# EAGLE schematic mcu_v01 (EAGLE 6.1)
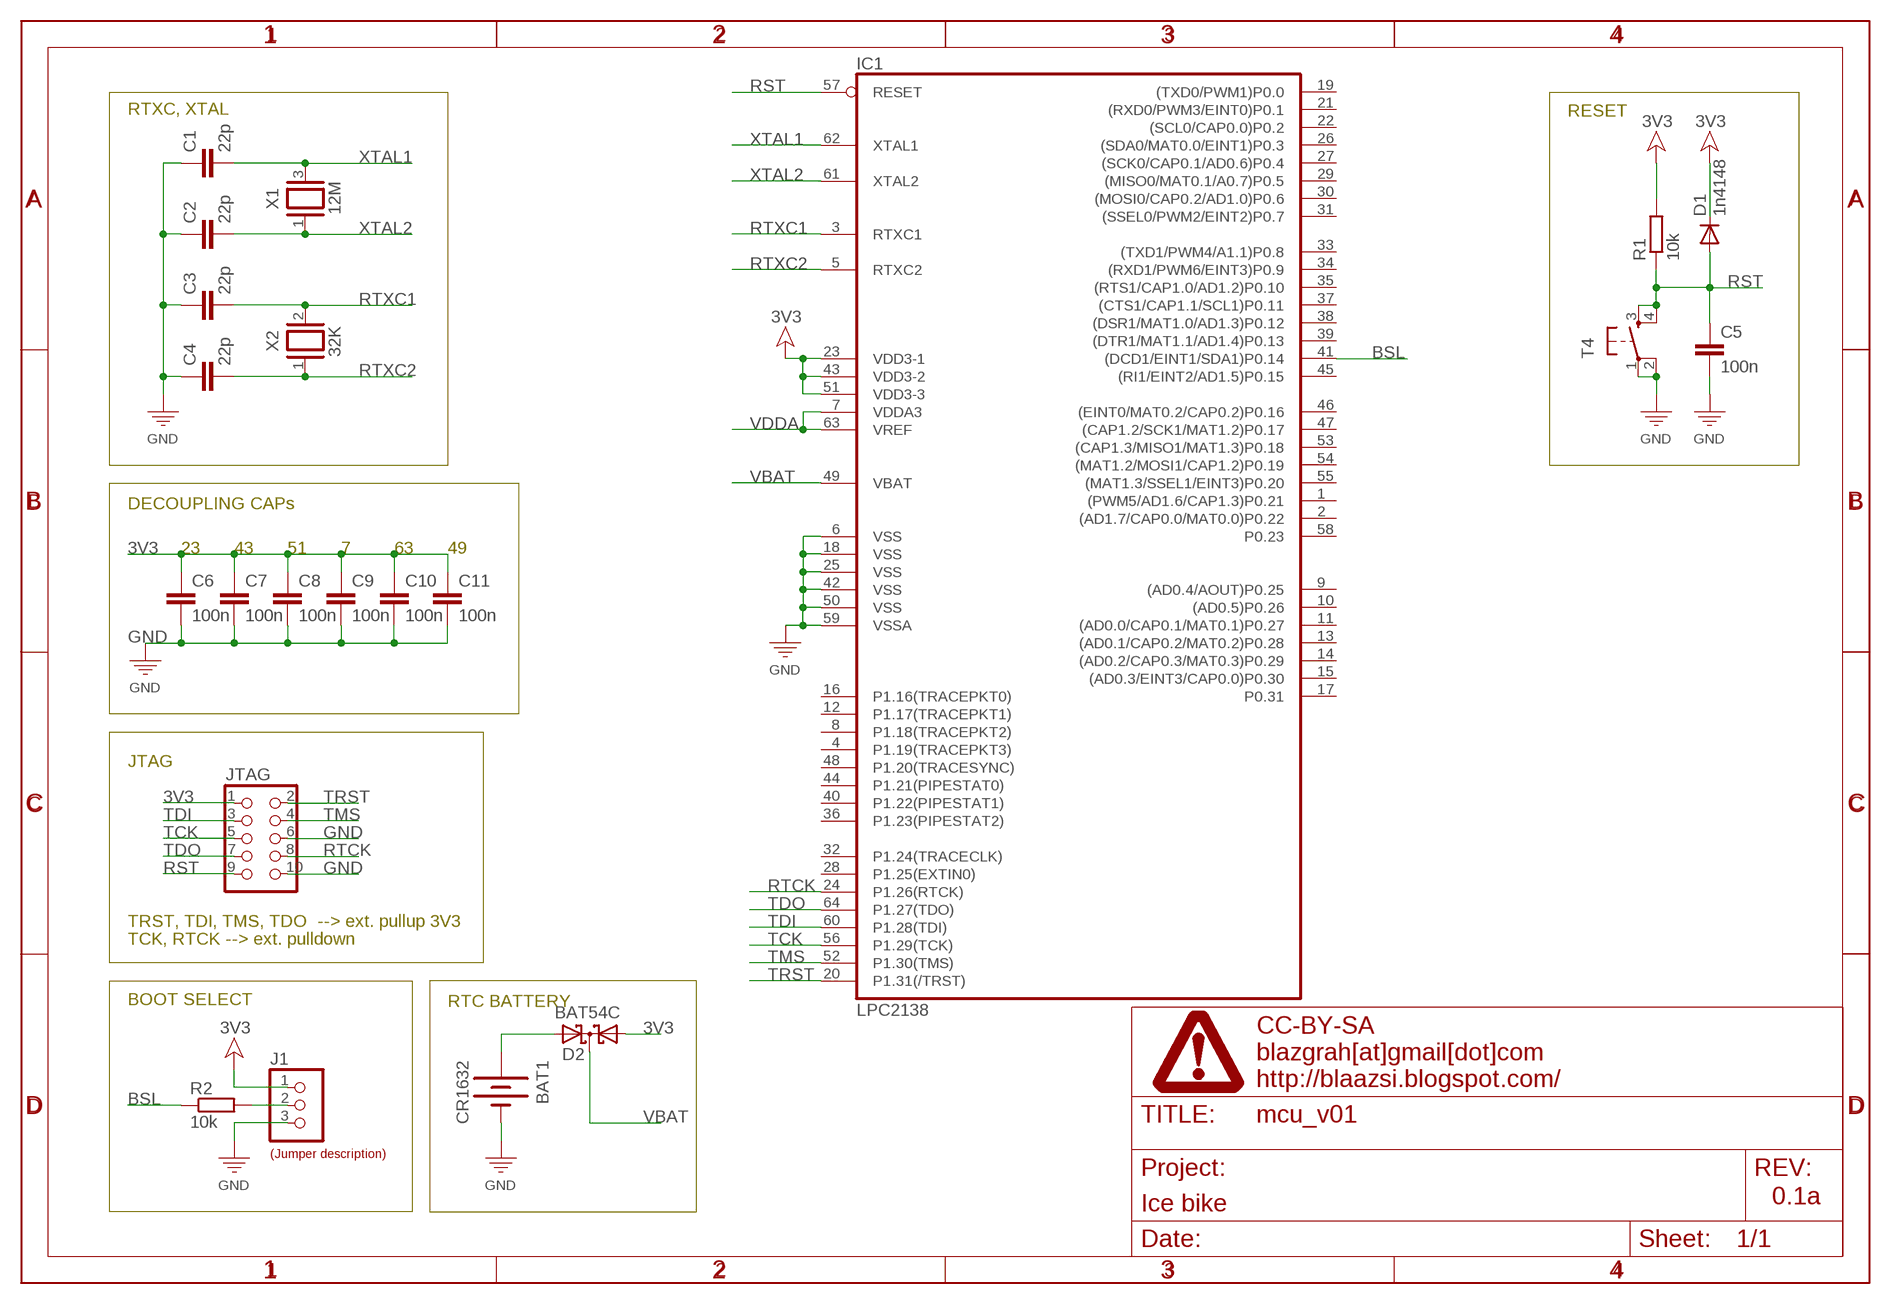
[diagram p0: schematic, sheet 1]

## Parts
BAT1  CR1632  BATTERY  [BATTERY_16MM_SDM]
C1  22p  C-EUC0603  [C0603]
C2  22p  C-EUC0603  [C0603]
C3  22p  C-EUC0603  [C0603]
C4  22p  C-EUC0603  [C0603]
C5  100n  C-EUC0603  [C0603]
C6  100n  C-EUC0603  [C0603]
C7  100n  C-EUC0603  [C0603]
C8  100n  C-EUC0603  [C0603]
C9  100n  C-EUC0603  [C0603]
C10  100n  C-EUC0603  [C0603]
C11  100n  C-EUC0603  [C0603]
D1  1n4148  1N41480603  [D0603]
D2  BAT54C  [SOT23]
IC1  LPC2138  LCP2138_LQFP64  [LQFP64]
J1  JUMPER_1X30805  [JP3_0805]
JTAG  CON_HEADER_2X05-PTH+SHROUDED_A  [PINSHRD_PTH_2X05]
R1  10k  R-EU0603  [R0603]
R2  10k  R-EU0603  [R0603]
T4  TACTIL_BUTTON  [BUTTON_SW_4P_SMD]
U$11  LABEL_JUMPER_1X3  [JUMP3_DESC]
U$13  FRAME_DINA4_L  [DP_LOGO]
X1  12M  CRYSTAL12MHZ  [ABMM2_6X3.6]
X2  32K  CRYSTAL32KHZ  [ABS10_4.9X1.8]

## Nets
3V3: C6.1 C7.1 C8.1 C9.1 C10.1 C11.1 D1.1(C) D2.1(A1) IC1.23(VDD3-1) IC1.43(VDD3-2) IC1.51(VDD3-3) JTAG.1 R1.2
BSL: IC1.41((DCD1/EINT1/SDA1)P0.14) R2.1
GND: BAT1.NEG C1.1 C2.1 C3.1 C4.1 C5.2 C6.2 C7.2 C8.2 C9.2 C10.2 C11.2 IC1.6(VSS) IC1.18(VSS) IC1.25(VSS) IC1.42(VSS) IC1.50(VSS) IC1.59(VSSA) J1.3 JTAG.6 JTAG.10 T4.1 T4.2
N$1: J1.2 R2.2
N$5: BAT1.POS1(POZ) BAT1.POS2(POZ) D2.2(A2)
P$1: J1.1 ; supply symbol labelled 3V3
RST: C5.1 D1.2(A) IC1.57(RESET) JTAG.9 R1.1 T4.3 T4.4
RTCK: IC1.24(P1.26(RTCK)) JTAG.8
RTXC1: C3.2 IC1.3(RTXC1) X2.2
RTXC2: C4.2 IC1.5(RTXC2) X2.1
TCK: IC1.56(P1.29(TCK)) JTAG.5
TDI: IC1.60(P1.28(TDI)) JTAG.3
TDO: IC1.64(P1.27(TDO)) JTAG.7
TMS: IC1.52(P1.30(TMS)) JTAG.4
TRST: IC1.20(P1.31(/TRST)) JTAG.2
VBAT: D2.3(CC) IC1.49(VBAT)
VDDA: IC1.7(VDDA3) IC1.63(VREF)
XTAL1: C1.2 IC1.62(XTAL1) X1.3
XTAL2: C2.2 IC1.61(XTAL2) X1.1
Unconnected: IC1.1((PWM5/AD1.6/CAP1.3)P0.21) IC1.2((AD1.7/CAP0.0/MAT0.0)P0.22) IC1.4(P1.19(TRACEPKT3)) IC1.8(P1.18(TRACEPKT2)) IC1.9((AD0.4/AOUT)P0.25) IC1.10((AD0.5)P0.26) IC1.11((AD0.0/CAP0.1/MAT0.1)P0.27) IC1.12(P1.17(TRACEPKT1)) IC1.13((AD0.1/CAP0.2/MAT0.2)P0.28) IC1.14((AD0.2/CAP0.3/MAT0.3)P0.29) IC1.15((AD0.3/EINT3/CAP0.0)P0.30) IC1.16(P1.16(TRACEPKT0)) IC1.17(P0.31) IC1.19((TXD0/PWM1)P0.0) IC1.21((RXD0/PWM3/EINT0)P0.1) IC1.22((SCL0/CAP0.0)P0.2) IC1.26((SDA0/MAT0.0/EINT1)P0.3) IC1.27((SCK0/CAP0.1/AD0.6)P0.4) IC1.28(P1.25(EXTIN0)) IC1.29((MISO0/MAT0.1/A0.7)P0.5) IC1.30((MOSI0/CAP0.2/AD1.0)P0.6) IC1.31((SSEL0/PWM2/EINT2)P0.7) IC1.32(P1.24(TRACECLK)) IC1.33((TXD1/PWM4/A1.1)P0.8) IC1.34((RXD1/PWM6/EINT3)P0.9) IC1.35((RTS1/CAP1.0/AD1.2)P0.10) IC1.36(P1.23(PIPESTAT2)) IC1.37((CTS1/CAP1.1/SCL1)P0.11) IC1.38((DSR1/MAT1.0/AD1.3)P0.12) IC1.39((DTR1/MAT1.1/AD1.4)P0.13) IC1.40(P1.22(PIPESTAT1)) IC1.44(P1.21(PIPESTAT0)) IC1.45((RI1/EINT2/AD1.5)P0.15) IC1.46((EINT0/MAT0.2/CAP0.2)P0.16) IC1.47((CAP1.2/SCK1/MAT1.2)P0.17) IC1.48(P1.20(TRACESYNC)) IC1.53((CAP1.3/MISO1/MAT1.3)P0.18) IC1.54((MAT1.2/MOSI1/CAP1.2)P0.19) IC1.55((MAT1.3/SSEL1/EINT3)P0.20) IC1.58(P0.23)

## Notes on the sheet
- RTXC, XTAL | RESET
- DECOUPLING CAPs
- 23 | 43 | 51 | 7 | 63 | 49
- JTAG
- TRST, TDI, TMS, TDO  --> ext. pullup 3V3
- TCK, RTCK --> ext. pulldown
- BOOT SELECT | RTC BATTERY
- 0.1a

## Library data of the parts
BAT1 = 00_beegee:BATTERY: BATTERY CONNECTORS
C1-C11 = 00_beegee:C-EU: CAPACITOR 22p ... 0603..... Farnell <http://si.farnell.com/multicomp/mcca000196/mlcc-0603-np0-50v-22pf/dp/1759057RL> ... 0.60€/100kom (dec. 2011) 100n .. 0603..... Farnell <http://si.farnell.com/multicomp/mcca000255/mlcc-0603-x7r-50v-100nf/dp/1759122> ... 0.60€/100kom (dec. 2011)
D1 = 00_beegee:1N4148: DIODE 1N4148 ... Farnell <http://si.farnell.com/vishay-semiconductor/1n4148ws-v-gs08/diode-100v-150ma-sod323/dp/1617737> ... 0.36€/5kom (dec. 2011)
D2 = diode:BAT54C: Schottky Diodes Source: Fairchild .. BAT54.pdf
IC1 = 00_beegee:LCP2138: NXP - LPC2138FBD64 32bit ARM7, 512k FLASH, LQFP64 ... Farnell <http://si.farnell.com/nxp/lpc2138fbd64/16-32bit-mcu-arm7-512k-flash-64lqfp/dp/1727704> ... 27.18€ (dec.2011)
J1 = 10_dang_prototyps:JUMPER_1X3; J12: USER; J23: BOOT
JTAG = 10_dang_prototyps:CON_HEADER_2X05: 2x05 pin header
R1 R2 = 00_beegee:R-EU: RESISTOR Resistors: 10k ... 0603 ... Farnell <http://si.farnell.com/panasonic/erj3geyj103v/resistor-0603-10k-5-0-1w/dp/2059627> ... 0.40€/50kom (dec.2011)
T4 = 00_beegee:TACTIL_BUTTON
U$11 = 10_dang_prototyps:LABEL_JUMPER_1X3: Nice formatted three legged jumperdescription Use attributes to change the values LEFT = With jumper to the left RIGHT = With jumper to the right; LEFT: BOOT; RIGHT: USER
U$13 = 10_dang_prototyps:FRAME_DINA4_L: A4 DP frame Standard Dangerous Prototypes schematic frame. Automagically adds the DP logo and standard texts to the PCB Use the atrribute in the schematic editor to change the fields.; LICENSE: CC-BY-SA; PROJECT: Ice bike; URL1: blazgrah[at]gmail[dot]com; URL2: http://blaazsi.blogspot.com/
X1 X2 = 00_beegee:CRYSTAL: CRYSTAL